# Altium schematic sheet Power_Reset.SchDoc: Power Input & Reset
size A4; DrawnBy: Samyar Sadat Akhavi; Revision: 1.0; SheetNumber: 2; SheetTotal: 13
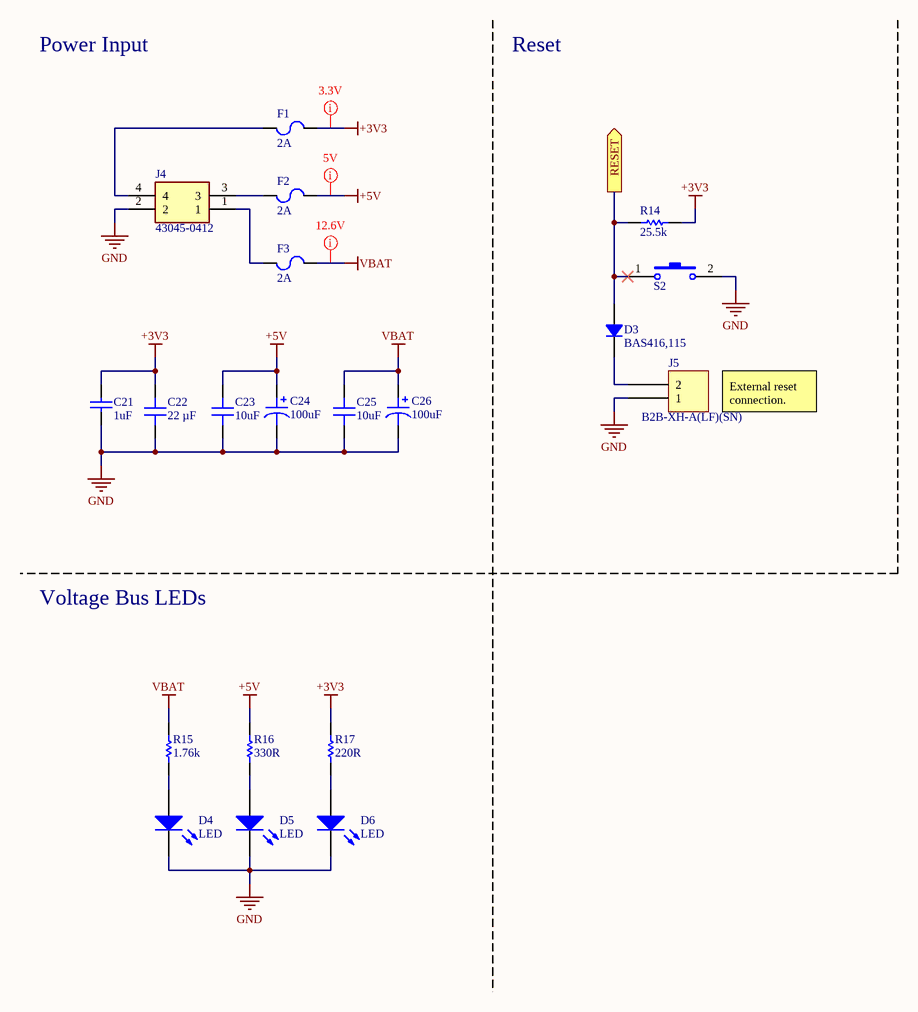
[diagram p0: Power_Reset.SchDoc]

## Parts
?  (no value)  (graphical)
C21  1uF  [CAP_SMD_805]
C22  22 µF  [CAP 0805_2012]
C23  10uF  [CAP 0805_2012]
C24  100uF  [CAP ALSMD 5.3MM H5.4MM]
C25  10uF  [CAP 0805_2012]
C26  100uF  [CAP ALSMD 6.6MM H5.4MM]
D3  BAS416,115  [SOD323 IPC]
D4  LED  [LED_1206]
D5  LED  [LED_1206]
D6  LED  [LED_1206]
F1  Current Rating (Amps): 2A  [FUSE 1206_3216 0.6MM]  (hidden comment: SF-1206F200-2)
F2  Current Rating (Amps): 2A  [FUSE 1206_3216 0.6MM]  (hidden comment: SF-1206F200-2)
F3  Current Rating (Amps): 2A  [FUSE 1206_3216 0.6MM]  (hidden comment: SF-1206F200-2)
J4  43045-0412  [43045-04YY_121314]
J5  B2B-XH-A(LF)(SN)  [JST XH B2B-XH-A]
R14  25.5k  [RES_0603]
R15  1.76k  [RES_0603]
R16  330R  [RES_0603]
R17  220R  [RES_0603]
S2  PTS815_SJK_250_SMTR_LFS  [PTS815SJK250SMTRLFS]  (value not drawn)

## Ports
RESET (out, see Sensors_IO_Board[2A])

## Nets
+3V3: C21.2 C22.2 F1.2 R14.2 R17.1
+5V: C23.2 C24.1 F2.2 R16.1
GND: C21.1 C22.1 C23.1 C24.2 C25.1 C26.2 D4.2(K) D5.2(K) D6.2(K) J4.2 J5.1 S2.2(NO)
VBAT: C25.2 C26.1 F3.2 R15.1
RESET: D3.2 R14.1 S2.1(COM) ; port RESET
NetD3_1: D3.1 J5.2
NetD4_1: D4.1(A) R15.2
NetD5_1: D5.1(A) R16.2
NetD6_1: D6.1(A) R17.2
NetF1_1: F1.1 J4.4
NetF2_1: F2.1 J4.3
NetF3_1: F3.1 J4.1

## Layout directives
rule Supply Nets [Voltage = 5.000]: +5V
rule Supply Nets [Voltage = 3.300]: +3V3
rule Supply Nets [Voltage = 12.60]: VBAT

## Notes on the sheet
- Power Input
- Reset
- External reset connection.
- Voltage Bus LEDs
- Sub-Project:
- Size:
- Drawn By:
- Revision:
- Date:
- File:
- Sheet:
- of

## Library data of the parts
? = Standard Title Block
C21 = Non-polar Capacitor: Generic Ceramic Capacitor; Voltage: 16V; Value: 1uF
C22 = CL21A226MAYNNNE: CAP CER 22UF 25V X5R 0805; manufacturer: Samsung Electro-Mechanics; Tolerance: ±20%; Part Number: CL21A226MAYNNNE; Capacitance: 22 µF; Applications: General Purpose; componentlink1description: Datasheet; componentlink1url: https://media.digikey.com/pdf/Data%20Sheets/Samsung%20PDFs/CL21A226MAYNNNE_Spec.pdf; componentlink2description: DigiKey Link; componentlink2url: https://www.digikey.com/en/products/detail/samsung-electro-mechanics/CL21A226MAYNNNE/10479857; Device Package: 0805 (2012 Metric); lastupdated: 2/9/2024 8:15:02 PM; Lifecycle Status: Active; Minimum Order: 1; Mounting Type: Surface Mount, MLCC; Operating Temperature: -55°C ~ 85°C; Package / Case: 0805 (2012 Metric); packaging: TapeAndReel; partid: 39209; Part Status: Active; price: 0.04; series: CL; Size / Dimension: 0.079" L x 0.049" W (2.00mm x 1.25mm); Supplier 1: DigiKey; Supplier Part Number 1: 1276-CL21A226MAYNNNECT-ND; Temperature Coefficient: X5R; Thickness (Max): 0.057" (1.45mm); value: 22 µF; Voltage - Rated: 25V
C23 C25 = CL21A106KOQNNNE: CAP CER 10UF 16V X5R 0805; manufacturer: Samsung Electro-Mechanics; Capacitance: 10 µF; Tolerance: ±10%; Part Number: CL21A106KOQNNNE; Applications: General Purpose; componentlink1description: Datasheet; componentlink1url: http://www.samsungsem.com/kr/support/product-search/mlcc/CL21A106KOQNNNE.jsp; componentlink2description: DigiKey Link; componentlink2url: https://www.digikey.com/en/products/detail/samsung-electro-mechanics/CL21A106KOQNNNE/3886754; Device Package: 0805 (2012 Metric); lastupdated: 2/9/2024 8:15:37 PM; Lifecycle Status: Active; Minimum Order: 1; Mounting Type: Surface Mount, MLCC; Operating Temperature: -55°C ~ 85°C; Package / Case: 0805 (2012 Metric); packaging: TapeAndReel; partid: 14297; Part Status: Active; price: 0.01; series: CL; Size / Dimension: 0.079" L x 0.049" W (2.00mm x 1.25mm); Supplier 1: DigiKey; Supplier Part Number 1: 1276-1096-1-ND; Temperature Coefficient: X5R; Thickness (Max): 0.055" (1.40mm); value: 10uF; Voltage - Rated: 16V
C24 = 865080142007: CAP ALUM 100UF 20% 6.3V SMD; manufacturer: Würth Elektronik; Capacitance: 100 µF; Impedance: 800 mOhms; Lifetime @ Temp.: 2000 Hrs @ 105°C; Polarization: Polar; Ripple Current @ High Frequency: 170 mA @ 100 kHz; Ripple Current @ Low Frequency: 110.5 mA @ 120 Hz; Surface Mount Land Size: 0.209" L x 0.209" W (5.30mm x 5.30mm); Part Number: 865080142007; Applications: General Purpose; componentlink1description: Datasheet; componentlink1url: https://katalog.we-online.de/pbs/datasheet/865080142007.pdf; componentlink2description: DigiKey Link; componentlink2url: https://www.digikey.com/en/products/detail/würth-elektronik/865080142007/5728067; Device Package: Radial, Can - SMD; Height - Seated (Max): 0.217" (5.50mm); lastupdated: 6/3/2024 7:53:12 PM; Lifecycle Status: Active; Minimum Order: 1; Mounting Type: Surface Mount; Operating Temperature: -55°C ~ 105°C; Package / Case: Radial, Can - SMD; packaging: TapeAndReel; partid: 7920; Part Status: Active; price: 0.12; series: WCAP-ASLI; Size / Dimension: 0.197" Dia (5.00mm); Supplier 1: DigiKey; Supplier Part Number 1: 732-8472-1-ND; Tolerance: ±20%; value: 100uF; Voltage - Rated: 6.3 V
C26 = 865080343009: CAP ALUM 100UF 20% 16V SMD; manufacturer: Würth Elektronik; Impedance: 520 mOhms; Lifetime @ Temp.: 2000 Hrs @ 105°C; Polarization: Polar; Ripple Current @ High Frequency: 255 mA @ 100 kHz; Ripple Current @ Low Frequency: 165.75 mA @ 120 Hz; Surface Mount Land Size: 0.260" L x 0.260" W (6.60mm x 6.60mm); Part Number: 865080343009; Applications: General Purpose; Capacitance: 100uF; componentlink1description: Datasheet; componentlink1url: https://katalog.we-online.de/pbs/datasheet/865080343009.pdf; componentlink2description: DigiKey Link; componentlink2url: https://www.digikey.com/en/products/detail/würth-elektronik/865080343009/5728014; Device Package: Radial, Can - SMD; Height - Seated (Max): 0.217" (5.50mm); lastupdated: 6/3/2024 7:53:35 PM; Lifecycle Status: Active; Minimum Order: 1; Mounting Type: Surface Mount; Operating Temperature: -55°C ~ 105°C; Package / Case: Radial, Can - SMD; packaging: TapeAndReel; partid: 8820; Part Status: Active; price: 0.16; series: WCAP-ASLI; Size / Dimension: 0.248" Dia (6.30mm); Supplier 1: DigiKey; Supplier Part Number 1: 732-8419-1-ND; Tolerance: ±20%; value: 100uF; Voltage - Rated: 16 V
D3 = BAS416,115: DIODE STANDARD 75V 200MA SOD323; Manufacturer: Nexperia USA Inc.; Capacitance @ Vr, F: 2pF @ 0V, 1MHz; Current - Reverse Leakage @ Vr: 5 nA @ 75 V; Reverse Recovery Time (trr): 3 µs; Speed: Small Signal =< 200mA (Io), Any Speed; Voltage - Forward (Vf) (Max) @ If: 1.25 V @ 150 mA; Part Number: BAS416,115; ComponentLink1Description: Datasheet; ComponentLink1URL: https://assets.nexperia.com/documents/data-sheet/BAS416.pdf; ComponentLink2Description: DigiKey Link; ComponentLink2URL: https://www.digikey.com/en/products/detail/nexperia-usa-inc/BAS416-115/1232094; Current - Average Rectified (Io): 200mA; Diode Type: Standard; LastUpdated: 10/27/2025 1:55:14 PM; Lifecycle Status: Active; Minimum Order: 1; Mounting Type: Surface Mount; Operating Temperature - Junction: 150°C (Max); Package / Case: SC-76, SOD-323; Packaging: TapeAndReel; PartId: 2951; Part Status: Active; Price: 0.02; Series: -; Supplier 1: DigiKey; Supplier Part Number 1: 1727-4807-1-ND; Supplier Device Package: SOD-323; Voltage - DC Reverse (Vr) (Max): 75 V
D4-D6 = LED: Indicator LED; Color: Blue
F1-F3 = SF-1206F200-2: FUSE BOARD MOUNT 2A 63VDC 1206; Manufacturer: Bourns Inc.; Approval Agency: UL; Breaking Capacity @ Rated Voltage: 50A; Fuse Type: Board Mount (Cartridge Style Excluded); Melting I²t: 0.181; Response Time: Fast Blow; Voltage Rating - DC: 63V; Part Number: SF-1206F200-2; Approvals: UL; ComponentLink1Description: Datasheet; ComponentLink1URL: https://www.bourns.com/pdfs/SF1206F.pdf; ComponentLink2Description: DigiKey Link; ComponentLink2URL: http://digikey.com/product-detail/en/bourns-inc/SF-1206F200-2/SF-1206F200-2CT-ND/1948205; Device Package: 1206 (3216 Metric); LastUpdated: 9/2/2020 1:30:42 AM; Lifecycle Status: Active; Minimum Order: 1; Mounting Type: Surface Mount; Operating Temperature: -40°C ~ 105°C; Package / Case: 1206 (3216 Metric); Packaging: TapeAndReel; Part Status: Active; Price: 0.31; Series: SinglFuse™ SF-1206F; Size / Dimension: 0.122" L x 0.061" W x 0.024" H (3.10mm x 1.55mm x 0.60mm); Supplier 1: DigiKey; Supplier Part Number 1: SF-1206F200-2CT-ND
J4 = 43045-0412: Connector; Manufacturer_Name: Molex; Datasheet Link: https://www.molex.com/pdm_docs/sd/430450612_sd.pdf; Height: 9.91mm; Manufacturer_Part_Number: 43045-0412; Mouser Part Number: 538-43045-0412; Mouser Price/Stock: https://www.mouser.co.uk/ProductDetail/Molex/43045-0412?qs=UeCeOHRHQebPBbEMDLocEw%3D%3D; Arrow Part Number: 43045-0412; Arrow Price/Stock: https://www.arrow.com/en/products/43045-0412/molex?utm_currency=USD&region=nac
J5 = B2B-XH-A(LF)(SN): CONN HEADER VERT 2POS 2.5MM; Manufacturer: JST Sales America Inc.; Contact Length - Post: 0.134" (3.40mm); Current Rating (Amps): 3A; Material Flammability Rating: UL94 V-0; Number of Positions: 2; Number of Positions Loaded: All; Pitch - Mating: 0.098" (2.50mm); Shrouding: Shrouded - 4 Wall; Style: Board to Cable/Wire; Voltage Rating: 250V; Part Number: B2B-XH-A(LF)(SN); ComponentLink1Description: Datasheet; ComponentLink1URL: http://www.jst-mfg.com/product/pdf/eng/eXH.pdf; ComponentLink2Description: DigiKey Link; ComponentLink2URL: http://digikey.com/product-detail/en/jst-sales-america-inc/B2B-XH-A-LF-SN/455-2247-ND/1651045; Connector Type: Header; Contact Finish - Mating: Tin; Contact Finish - Post: Tin; Contact Material: Brass; Contact Shape: Square; Contact Type: Male Pin; Fastening Type: Detent Lock; Insulation Color: Natural; Insulation Height: 0.276" (7.00mm); Insulation Material: Polyamide (PA66), Nylon 6/6; LastUpdated: 1/12/2020 11:46:08 PM; Lifecycle Status: Active; Minimum Order: 1; Mounting Type: Through Hole; Number of Rows: 1; Operating Temperature: -25°C ~ 85°C; Packaging: Bulk; PartId: 67; Part Status: Active; Price: 0.15; Series: XH; Supplier 1: DigiKey; Supplier Part Number 1: 455-2247-ND; Termination: Press-Fit, Solder
R14-R17 = Resistor: Power: 1/8W
  R14: Value: 25.5k
  R15: Value: 1.76k
  R16: Value: 330R
  R17: Value: 220R
S2 = PTS815_SJK_250_SMTR_LFS: Switch; Manufacturer_Name: C & K COMPONENTS; Manufacturer_Part_Number: PTS815 SJK 250 SMTR LFS; Datasheet Link: https://www.mouser.com/datasheet/2/60/pts815-1535658.pdf; Height: 2mm; Mouser Part Number: 611-PTS815SJK250SMTR; Mouser Price/Stock: https://www.mouser.co.uk/ProductDetail/CK/PTS815-SJK-250-SMTR-LFS?qs=ahcBuItHZ3yETpGYMHf%2FgQ%3D%3D; Arrow Part Number: PTS815 SJK 250 SMTR LFS; Arrow Price/Stock: https://www.arrow.com/en/products/pts815-sjk-250-smtr-lfs/ck